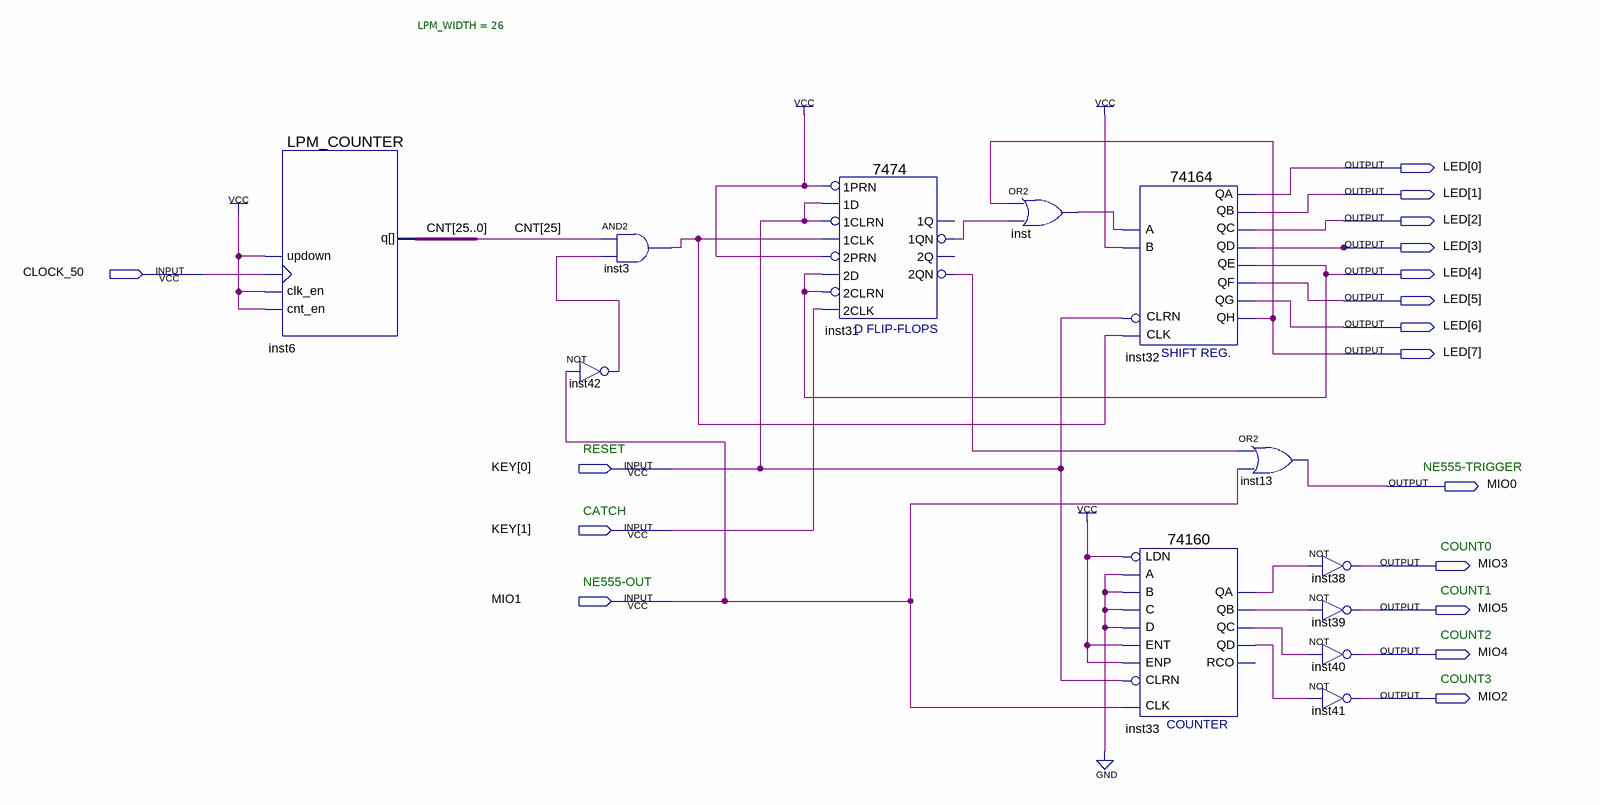
[diagram p0: schematic sheet]
// Quartus schematic Lab3_Stud.bdf as structural Verilog: 12 symbols, 17 pins
module Lab3_Stud (
  input  CLOCK_50,
  input  [1:0] KEY,
  input  MIO1,
  output [7:0] LED,
  output MIO0,
  output MIO3,
  output MIO5,
  output MIO4,
  output MIO2
);

  wire inst3_out, inst31_1qn, inst31_2qn, inst33_qa, inst33_qb, inst33_qc, inst33_qd, inst42_out, inst_out;
  wire [25:0] CNT;

  LPM_COUNTER #(.LPM_WIDTH(26)) inst6 (.clk_en(1'b1), .clock(CLOCK_50), .cnt_en(1'b1), .updown(1'b1), .q(CNT));
  and inst3 (inst3_out, CNT[25], inst42_out);
  not inst42 (inst42_out, MIO1);
  \7474  inst31 (
    .\2D (LED[4]), .\2PRN (1'b1), .\1CLK (inst3_out), .\1D (KEY[0]), .\1PRN (1'b1), .\2CLK (KEY[1]),
    .\2CLRN (LED[4]), .\1CLRN (KEY[0]), .\1QN (inst31_1qn), .\2QN (inst31_2qn));  // open: 2Q, 1Q
  or inst (inst_out, LED[7], inst31_1qn);
  \74164  inst32 (
    .CLRN(KEY[0]), .CLK(inst3_out), .B(1'b1), .A(inst_out), .QD(LED[3]), .QC(LED[2]), .QA(LED[0]),
    .QF(LED[5]), .QH(LED[7]), .QG(LED[6]), .QE(LED[4]), .QB(LED[1]));
  \74160  inst33 (
    .CLK(MIO1), .ENT(1'b1), .A(1'b0), .B(1'b0), .C(1'b0), .D(1'b0), .LDN(1'b1), .ENP(1'b1), .CLRN(KEY[0]),
    .QD(inst33_qd), .QA(inst33_qa), .QB(inst33_qb), .QC(inst33_qc));  // open: RCO
  or inst13 (MIO0, inst31_2qn, MIO1);
  not inst38 (MIO3, inst33_qa);
  not inst39 (MIO5, inst33_qb);
  not inst40 (MIO4, inst33_qc);
  not inst41 (MIO2, inst33_qd);

  // Notes on the sheet:
  //   RESET
  //   NE555-TRIGGER
  //   CATCH
  //   COUNT0
  //   NE555-OUT
  //   COUNT1
  //   COUNT2
  //   COUNT3
endmodule
